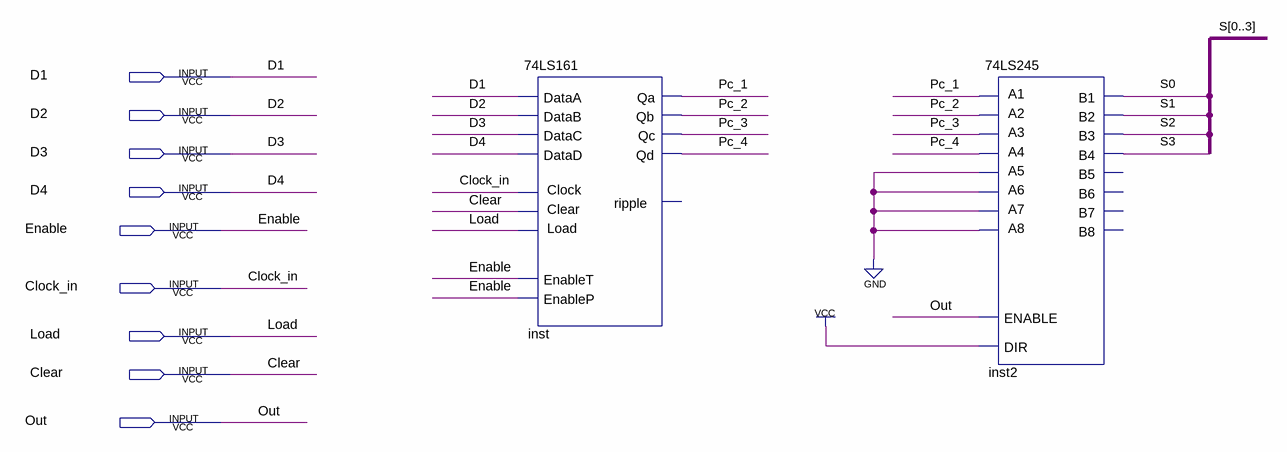
[diagram p0: schematic sheet]
// Quartus schematic Program_counter.bdf as structural Verilog: 2 symbols, 9 pins
module Program_counter (
  input  D1,
  input  D2,
  input  D3,
  input  D4,
  input  Enable,
  input  Clock_in,
  input  Load,
  input  Clear,
  input  Out
);

  wire inst2_a5, Pc_1, Pc_2, Pc_3, Pc_4;
  wire [3:0] S;

  \74LS161  inst (
    .Clock(Clock_in), .DataA(D1), .Clear(Clear), .DataB(D2), .Load(Load), .EnableP(Enable), .EnableT(Enable),
    .DataC(D3), .DataD(D4), .Qa(Pc_1), .Qb(Pc_2), .Qc(Pc_3), .Qd(Pc_4));  // open: ripple
  \74LS245  inst2 (
    .ENABLE(Out), .DIR(1'b1), .B1(S[0]), .B2(S[1]), .B3(S[2]), .B4(S[3]), .A1(Pc_1), .A2(Pc_2), .A3(Pc_3),
    .A4(Pc_4), .A5(inst2_a5), .A6(inst2_a5), .A7(inst2_a5), .A8(inst2_a5));  // open: B5, B6, B7, B8
  // also tied to GND on the sheet: inst2_a5
endmodule
